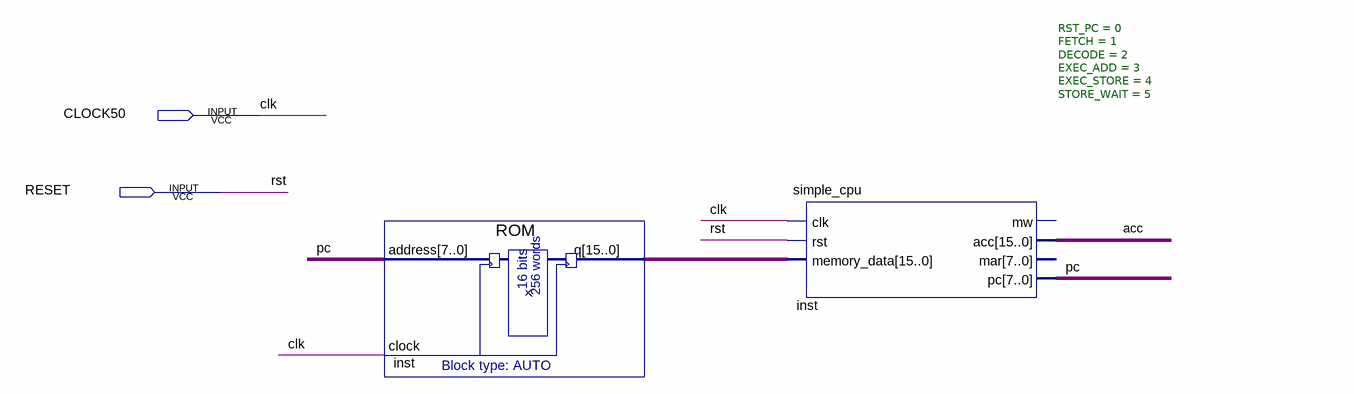
[diagram p0: schematic sheet]
// Quartus schematic cpu.bdf as structural Verilog: 2 symbols, 2 pins
module cpu (
  input  CLOCK50,
  input  RESET
);

  wire acc, pc;
  wire [15:0] inst_q;

  ROM inst (.address({8{pc}}), .clock(CLOCK50), .q(inst_q));
  simple_cpu #(.RST_PC(0), .FETCH(1), .DECODE(2), .EXEC_ADD(3), .EXEC_STORE(4), .STORE_WAIT(5)) inst_dup2 (
    .clk(CLOCK50), .rst(RESET), .memory_data(inst_q), .acc(acc), .pc(pc));  // open: mw, mar

  // Other names for the same wires on the sheet: clk = CLOCK50; rst = RESET
endmodule
